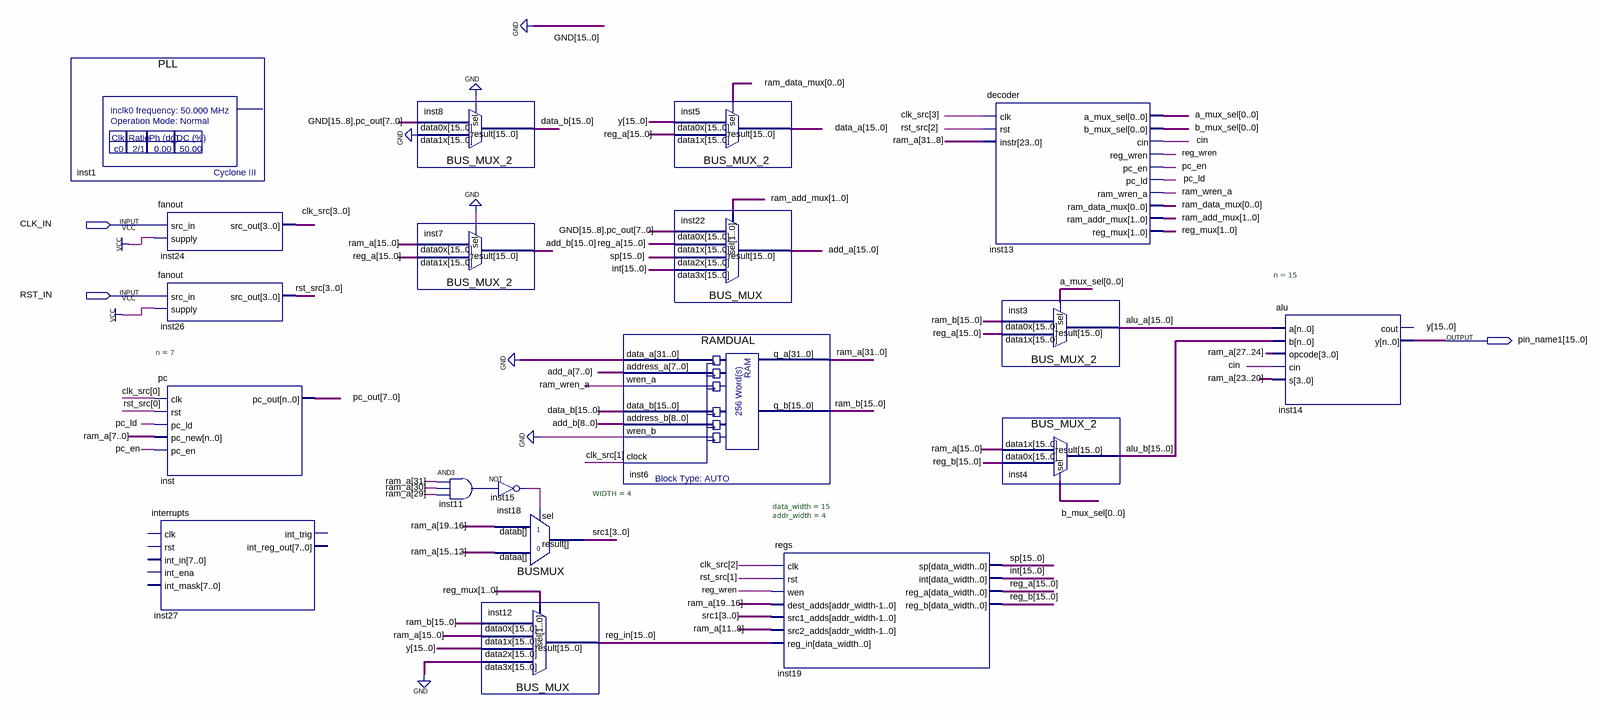
[diagram p0: schematic sheet]
// Quartus schematic cpu.bdf as structural Verilog: 19 symbols, 3 pins
module cpu (
  input  CLK_IN,
  input  RST_IN,
  output [15:0] pin_name1
);

  wire cin, inst11_out, inst15_out, pc_en, pc_ld, ram_wren_a, reg_wren;
  wire [0:0] a_mux_sel, b_mux_sel, ram_data_mux;
  wire [1:0] ram_add_mux, reg_mux;
  wire [3:0] clk_src, rst_src, src1;
  wire [7:0] pc_out;
  wire [15:0] add_a, add_b, alu_a, alu_b, data_a, data_b, \int , ram_b, reg_a, reg_b, reg_in, sp;
  wire [31:0] ram_a;

  PLL inst1 ();
  fanout inst24 (.src_in(CLK_IN), .supply(1'b1), .src_out(clk_src));
  fanout inst26 (.src_in(RST_IN), .supply(1'b1), .src_out(rst_src));
  pc #(.n(7)) inst (
    .clk(clk_src[0]), .rst(rst_src[0]), .pc_ld(pc_ld), .pc_new(ram_a[7:0]), .pc_en(pc_en), .pc_out(pc_out));
  interrupts inst27 ();  // open: clk, rst, int_in, int_ena, int_mask, int_trig, int_reg_out
  BUS_MUX_2 inst8 (.data1x({16{1'b0}}), .data0x({{8{1'b0}}, pc_out}), .sel(1'b0), .result(data_b));
  BUS_MUX_2 inst7 (.data1x(reg_a), .data0x(ram_a[15:0]), .sel(1'b0), .result(add_b));
  and inst11 (inst11_out, ram_a[31], ram_a[30], ram_a[29]);
  BUS_MUX inst12 (
    .data3x({16{1'b0}}), .data2x(pin_name1), .data1x(ram_a[15:0]), .data0x(ram_b), .sel(reg_mux),
    .result(reg_in));
  not inst15 (inst15_out, inst11_out);
  BUSMUX #(.WIDTH(4)) inst18 (.datab(ram_a[19:16]), .sel(inst15_out), .dataa(ram_a[15:12]), .result(src1));
  RAMDUAL inst6 (
    .data_a({32{1'b0}}), .address_a(add_a[7:0]), .wren_a(ram_wren_a), .data_b(data_b),
    .address_b(add_b[8:0]), .wren_b(1'b0), .clock(clk_src[1]), .q_a(ram_a), .q_b(ram_b));
  BUS_MUX_2 inst5 (.data1x(reg_a), .data0x(pin_name1), .sel(ram_data_mux[0]), .result(data_a));
  BUS_MUX inst22 (
    .data3x(\int ), .data2x(sp), .data1x(reg_a), .data0x({{8{1'b0}}, pc_out}), .sel(ram_add_mux),
    .result(add_a));
  regs #(.data_width(15), .addr_width(4)) inst19 (
    .clk(clk_src[2]), .rst(rst_src[1]), .wen(reg_wren), .dest_adds(ram_a[19:16]), .src1_adds(src1),
    .src2_adds(ram_a[11:8]), .reg_in(reg_in), .sp(sp), .\int (\int ), .reg_a(reg_a), .reg_b(reg_b));
  decoder inst13 (
    .clk(clk_src[3]), .rst(rst_src[2]), .instr(ram_a[31:8]), .a_mux_sel(a_mux_sel[0]),
    .b_mux_sel(b_mux_sel[0]), .cin(cin), .reg_wren(reg_wren), .pc_en(pc_en), .pc_ld(pc_ld),
    .ram_wren_a(ram_wren_a), .ram_data_mux(ram_data_mux[0]), .ram_addr_mux(ram_add_mux), .reg_mux(reg_mux));
  BUS_MUX_2 inst3 (.data1x(reg_a), .data0x(ram_b), .sel(a_mux_sel[0]), .result(alu_a));
  BUS_MUX_2 inst4 (.data1x(ram_a[15:0]), .data0x(reg_b), .sel(b_mux_sel[0]), .result(alu_b));
  alu #(.n(15)) inst14 (
    .a(alu_a), .b(alu_b), .opcode(ram_a[27:24]), .cin(cin), .s(ram_a[23:20]), .y(pin_name1));  // open: cout

  // Other names for the same wires on the sheet: y[15:0] = pin_name1
endmodule
